# EAGLE schematic shupito (EAGLE 5.11)
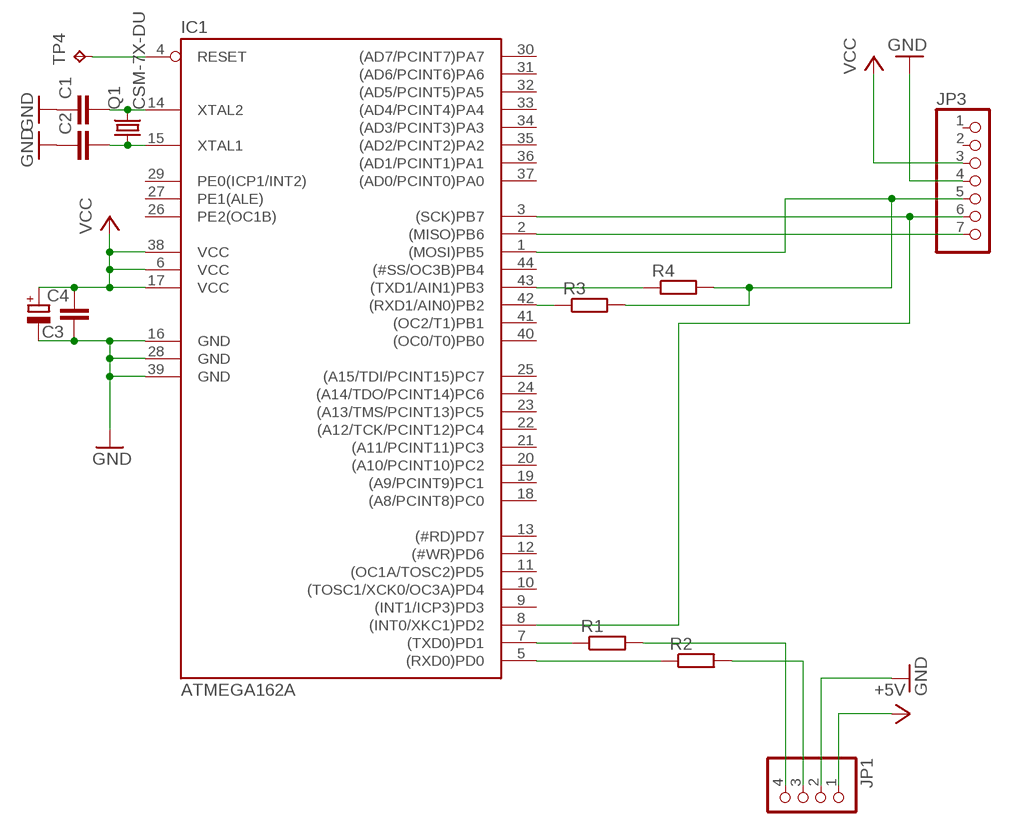
[diagram p0: schematic, sheet 1]

## Parts
C1  C-EUC0603  [C0603]
C2  C-EUC0603  [C0603]
C3  C-EUC0603  [C0603]
C4  CPOL-EUA/3216-18R  [A/3216-18R]
IC1  ATMEGA162A  [TQFP44]
JP1  PINHD-1X4/90  [1X04/90]
JP3  PINHD-1X7/90  [1X07/90]
Q1  CSM-7X-DU  [CSM-7X-DU]
R1  R-EU_R0603  [R0603]
R2  R-EU_R0603  [R0603]
R3  R-EU_R0603  [R0603]
R4  R-EU_R0603  [R0603]
TP4  TPTP20R  [TP20R]

## Nets
+5V: JP1.1
GND: C1.1 C2.1 C3.1 C4.- IC1.16(GND) IC1.28(GND) IC1.39(GND) JP1.2 JP3.4
N$1: IC1.7((TXD0)PD1) R1.1
N$2: JP1.3 R2.2
N$3: IC1.5((RXD0)PD0) R2.1
N$4: JP1.4 R1.2
N$5: IC1.42((RXD1/AIN0)PB2) R3.1
N$6: IC1.2((MISO)PB6) JP3.7
N$8: IC1.4(RESET) TP4.TP
N$10: IC1.43((TXD1/AIN1)PB3) R4.1
N$11: IC1.1((MOSI)PB5) JP3.5 R3.2 R4.2
N$13: IC1.3((SCK)PB7) IC1.8((INT0/XKC1)PD2) JP3.6
N$14: C1.2 IC1.14(XTAL2) Q1.2
N$15: C2.2 IC1.15(XTAL1) Q1.1
VCC: C3.2 C4.+ IC1.6(VCC) IC1.17(VCC) IC1.38(VCC) JP3.3
Unconnected: IC1.9((INT1/ICP3)PD3) IC1.10((TOSC1/XCK0/OC3A)PD4) IC1.11((OC1A/TOSC2)PD5) IC1.12((#WR)PD6) IC1.13((#RD)PD7) IC1.18((A8/PCINT8)PC0) IC1.19((A9/PCINT9)PC1) IC1.20((A10/PCINT10)PC2) IC1.21((A11/PCINT11)PC3) IC1.22((A12/TCK/PCINT12)PC4) IC1.23((A13/TMS/PCINT13)PC5) IC1.24((A14/TDO/PCINT14)PC6) IC1.25((A15/TDI/PCINT15)PC7) IC1.26(PE2(OC1B)) IC1.27(PE1(ALE)) IC1.29(PE0(ICP1/INT2)) IC1.30((AD7/PCINT7)PA7) IC1.31((AD6/PCINT6)PA6) IC1.32((AD5/PCINT5)PA5) IC1.33((AD4/PCINT4)PA4) IC1.34((AD3/PCINT3)PA3) IC1.35((AD2/PCINT2)PA2) IC1.36((AD1/PCINT1)PA1) IC1.37((AD0/PCINT0)PA0) IC1.40((OC0/T0)PB0) IC1.41((OC2/T1)PB1) IC1.44((#SS/OC3B)PB4) JP3.1 JP3.2

## Library data of the parts
C1-C3 = rcl:C-EU: CAPACITOR, European symbol
C4 = rcl:CPOL-EU: POLARIZED CAPACITOR, European symbol
IC1 = atmega162:ATMEGA162: MICROCONTROLLER 16 Kbytes FLASH 1K bytes SRAM 512 bytes EEPROM UART
JP1 = pinhead:PINHD-1X4: PIN HEADER
JP3 = pinhead:PINHD-1X7: PIN HEADER
Q1 = crystal:CSM-7X-DU: SMD CRYSTAL Source: www.ecsxtal.com .. Crystal 3.6864MHz CSM_7X_DU.PDF; OC_FARNELL: unknown; OC_NEWARK: unknown
R1-R4 = rcl:R-EU_: RESISTOR, European symbol
TP4 = testpad:TP: Test pad